# EAGLE design radiomodul (EAGLE 8.5.1)

## Sheet 1 of 3: MCU
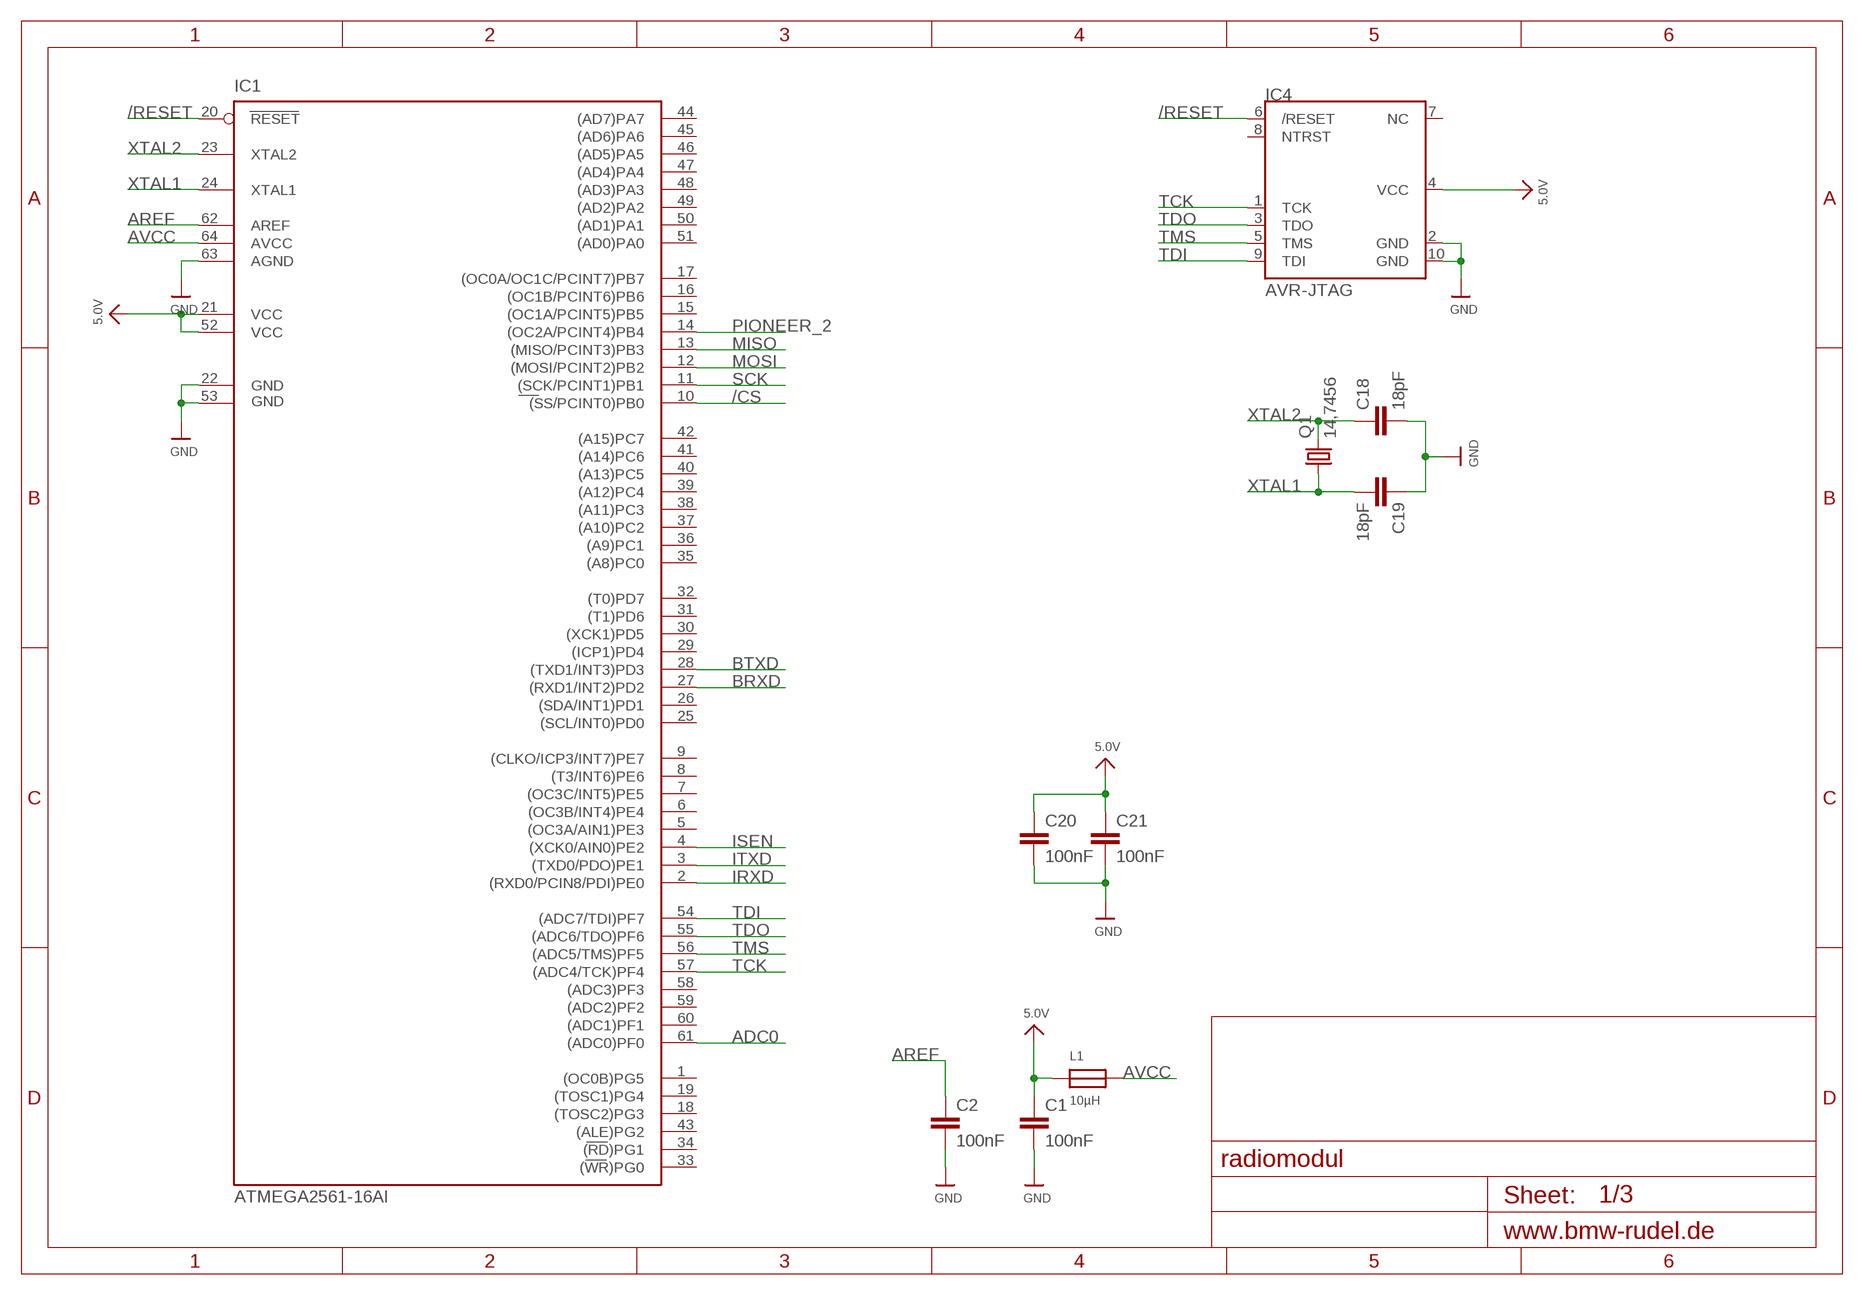
[diagram p0: schematic, sheet 1]

### Parts
C1  100nF  C-EUC0805  [C0805]
C2  100nF  C-EUC0805  [C0805]
C18  18pF  C-EUC0805  [C0805]
C19  18pF  C-EUC0805  [C0805]
C20  100nF  C-EUC0805  [C0805]
C21  100nF  C-EUC0805  [C0805]
IC1  ATMEGA2561-16AI  [TQFP64]
IC4  AVR-JTAG  [2X05_1.27MM_SMT]
L1  10µH  FERRITE1206  [1206]
Q1  14,7456  CRYSTALHC49UP  [HC49UP]

### Nets
5.0V: C1.1 C20.1 C21.1 IC1.21(VCC) IC1.52(VCC1) IC4.4(VCC) L1.1 ; also sheet 2,3
/CS: IC1.10((SS/PCINT0)PB0) ; also sheet 2
/RESET: IC1.20(RESET) IC4.6(/RESET) ; also sheet 3
ADC0: IC1.61((ADC0)PF0) ; also sheet 2
AREF: C2.1 IC1.62(AREF)
AVCC: IC1.64(AVCC) L1.2
BRXD: IC1.27((RXD1/INT2)PD2) ; also sheet 2
BTXD: IC1.28((TXD1/INT3)PD3) ; also sheet 2
GND: C1.2 C2.2 C18.2 C19.1 C20.2 C21.2 IC1.22(GND) IC1.53(GND1) IC1.63(AGND) IC4.2(GND) IC4.10(GND) ; also sheet 2,3
IRXD: IC1.2((RXD0/PCIN8/PDI)PE0) ; also sheet 2
ISEN: IC1.4((XCK0/AIN0)PE2) ; also sheet 2
ITXD: IC1.3((TXD0/PDO)PE1) ; also sheet 2
MISO: IC1.13((MISO/PCINT3)PB3) ; also sheet 2
MOSI: IC1.12((MOSI/PCINT2)PB2) ; also sheet 2
PIONEER_2: IC1.14((OC2A/PCINT4)PB4) ; also sheet 3
SCK: IC1.11((SCK/PCINT1)PB1) ; also sheet 2
TCK: IC1.57((ADC4/TCK)PF4) IC4.1(TCK)
TDI: IC1.54((ADC7/TDI)PF7) IC4.9(TDI)
TDO: IC1.55((ADC6/TDO)PF6) IC4.3(TDO)
TMS: IC1.56((ADC5/TMS)PF5) IC4.5(TMS)
XTAL1: C19.2 IC1.24(XTAL1) Q1.1
XTAL2: C18.1 IC1.23(XTAL2) Q1.2
Unconnected: IC1.1((OC0B)PG5) IC1.5((OC3A/AIN1)PE3) IC1.6((OC3B/INT4)PE4) IC1.7((OC3C/INT5)PE5) IC1.8((T3/INT6)PE6) IC1.9((CLKO/ICP3/INT7)PE7) IC1.15((OC1A/PCINT5)PB5) IC1.16((OC1B/PCINT6)PB6) IC1.17((OC0A/OC1C/PCINT7)PB7) IC1.18((TOSC2)PG3) IC1.19((TOSC1)PG4) IC1.25((SCL/INT0)PD0) IC1.26((SDA/INT1)PD1) IC1.29((ICP1)PD4) IC1.30((XCK1)PD5) IC1.31((T1)PD6) IC1.32((T0)PD7) IC1.33((WR)PG0) IC1.34((RD)PG1) IC1.35((A8)PC0) IC1.36((A9)PC1) IC1.37((A10)PC2) IC1.38((A11)PC3) IC1.39((A12)PC4) IC1.40((A13)PC5) IC1.41((A14)PC6) IC1.42((A15)PC7) IC1.43((ALE)PG2) IC1.44((AD7)PA7) IC1.45((AD6)PA6) IC1.46((AD5)PA5) IC1.47((AD4)PA4) IC1.48((AD3)PA3) IC1.49((AD2)PA2) IC1.50((AD1)PA1) IC1.51((AD0)PA0) IC1.58((ADC3)PF3) IC1.59((ADC2)PF2) IC1.60((ADC1)PF1) IC4.7(NC) IC4.8(NTRST)

## Sheet 2 of 3: Connectivity
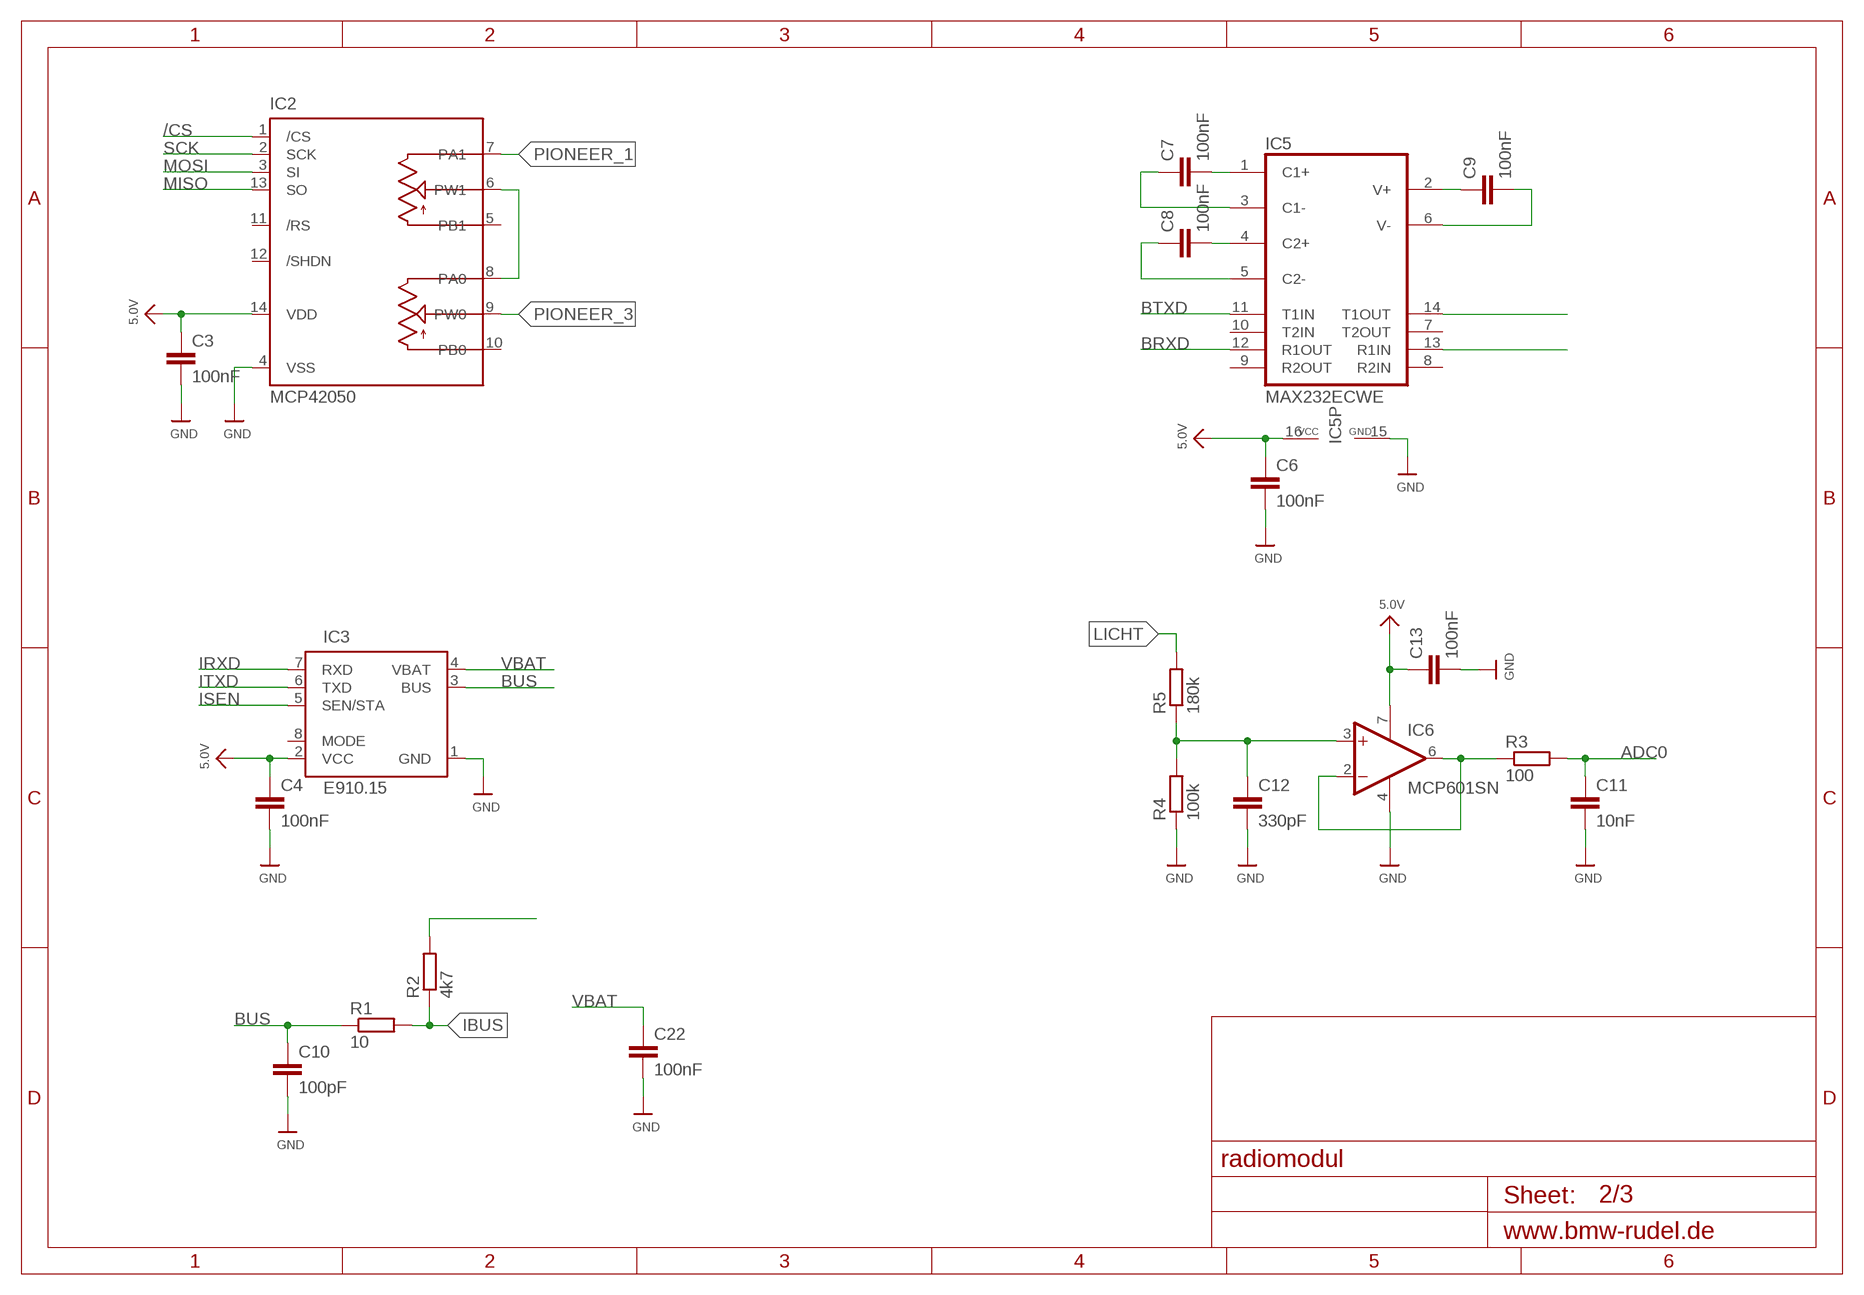
[diagram p1: schematic, sheet 2]

### Parts
C3  100nF  C-EUC0805  [C0805]
C4  100nF  C-EUC0805  [C0805]
C6  100nF  C-EUC0805  [C0805]
C7  100nF  C-EUC0805  [C0805]
C8  100nF  C-EUC0805  [C0805]
C9  100nF  C-EUC0805  [C0805]
C10  100pF  C-EUC0805  [C0805]
C11  10nF  C-EUC0805  [C0805]
C12  330pF  C-EUC0805  [C0805]
C13  100nF  C-EUC0805  [C0805]
C22  100nF  C-EUC0805  [C0805]
IC2  MCP42050  [SO-14]
IC3  E910.15  [SO8]
IC5  MAX232ECWE  [SO16L]
IC6  MCP601SN  [SO08]
R1  10  R-EU_R0805  [R0805]
R2  4k7  R-EU_R0805  [R0805]
R3  100  R-EU_R0805  [R0805]
R4  100k  R-EU_R0805  [R0805]
R5  180k  R-EU_R0805  [R0805]

### Nets
5.0V: C3.1 C4.1 C6.1 C13.1 IC2.14(VDD) IC3.2(VCC) IC5.16(VCC) IC6.7(V+) ; also sheet 1,3
/CS: IC2.1(/CS) ; also sheet 1
ADC0: C11.1 R3.2 ; also sheet 1
BECKER_RXD: IC5.13(R1IN) ; also sheet 3
BECKER_TXD: IC5.14(T1OUT) ; also sheet 3
BRXD: IC5.12(R1OUT) ; also sheet 1
BTXD: IC5.11(T1IN) ; also sheet 1
BUS: C10.1 IC3.3(BUS) R1.1
GND: C3.2 C4.2 C6.2 C10.2 C11.2 C12.2 C13.2 C22.2 IC2.4(VSS) IC3.1(GND) IC5.15(GND) IC6.4(V-) R4.1 ; also sheet 1,3
IBUS: R1.2 R2.1 ; also sheet 3
IRXD: IC3.7(RXD) ; also sheet 1
ISEN: IC3.5(SEN/STA) ; also sheet 1
ITXD: IC3.6(TXD) ; also sheet 1
LICHT: R5.2 ; also sheet 3
MISO: IC2.13(SO) ; also sheet 1
MOSI: IC2.3(SI) ; also sheet 1
N$1: IC2.6(PW1) IC2.8(PA0)
N$4: C7.1 IC5.3(C1-)
N$5: C12.1 IC6.3(+IN) R4.2 R5.1
N$6: C8.1 IC5.5(C2-)
N$7: IC6.2(-IN) IC6.6(OUT) R3.1
N$8: C8.2 IC5.4(C2+)
N$9: C9.2 IC5.6(V-)
N$10: C9.1 IC5.2(V+)
N$11: C7.2 IC5.1(C1+)
PIONEER_1: IC2.7(PA1) ; also sheet 3
PIONEER_3: IC2.9(PW0) ; also sheet 3
SAFT: R2.2 ; also sheet 3
SCK: IC2.2(SCK) ; also sheet 1
VBAT: C22.1 IC3.4(VBAT)
Unconnected: IC2.5(PB1) IC2.10(PB0) IC2.11(/RS) IC2.12(/SHDN) IC3.8(MODE) IC5.7(T2OUT) IC5.8(R2IN) IC5.9(R2OUT) IC5.10(T2IN)

## Sheet 3 of 3: Power
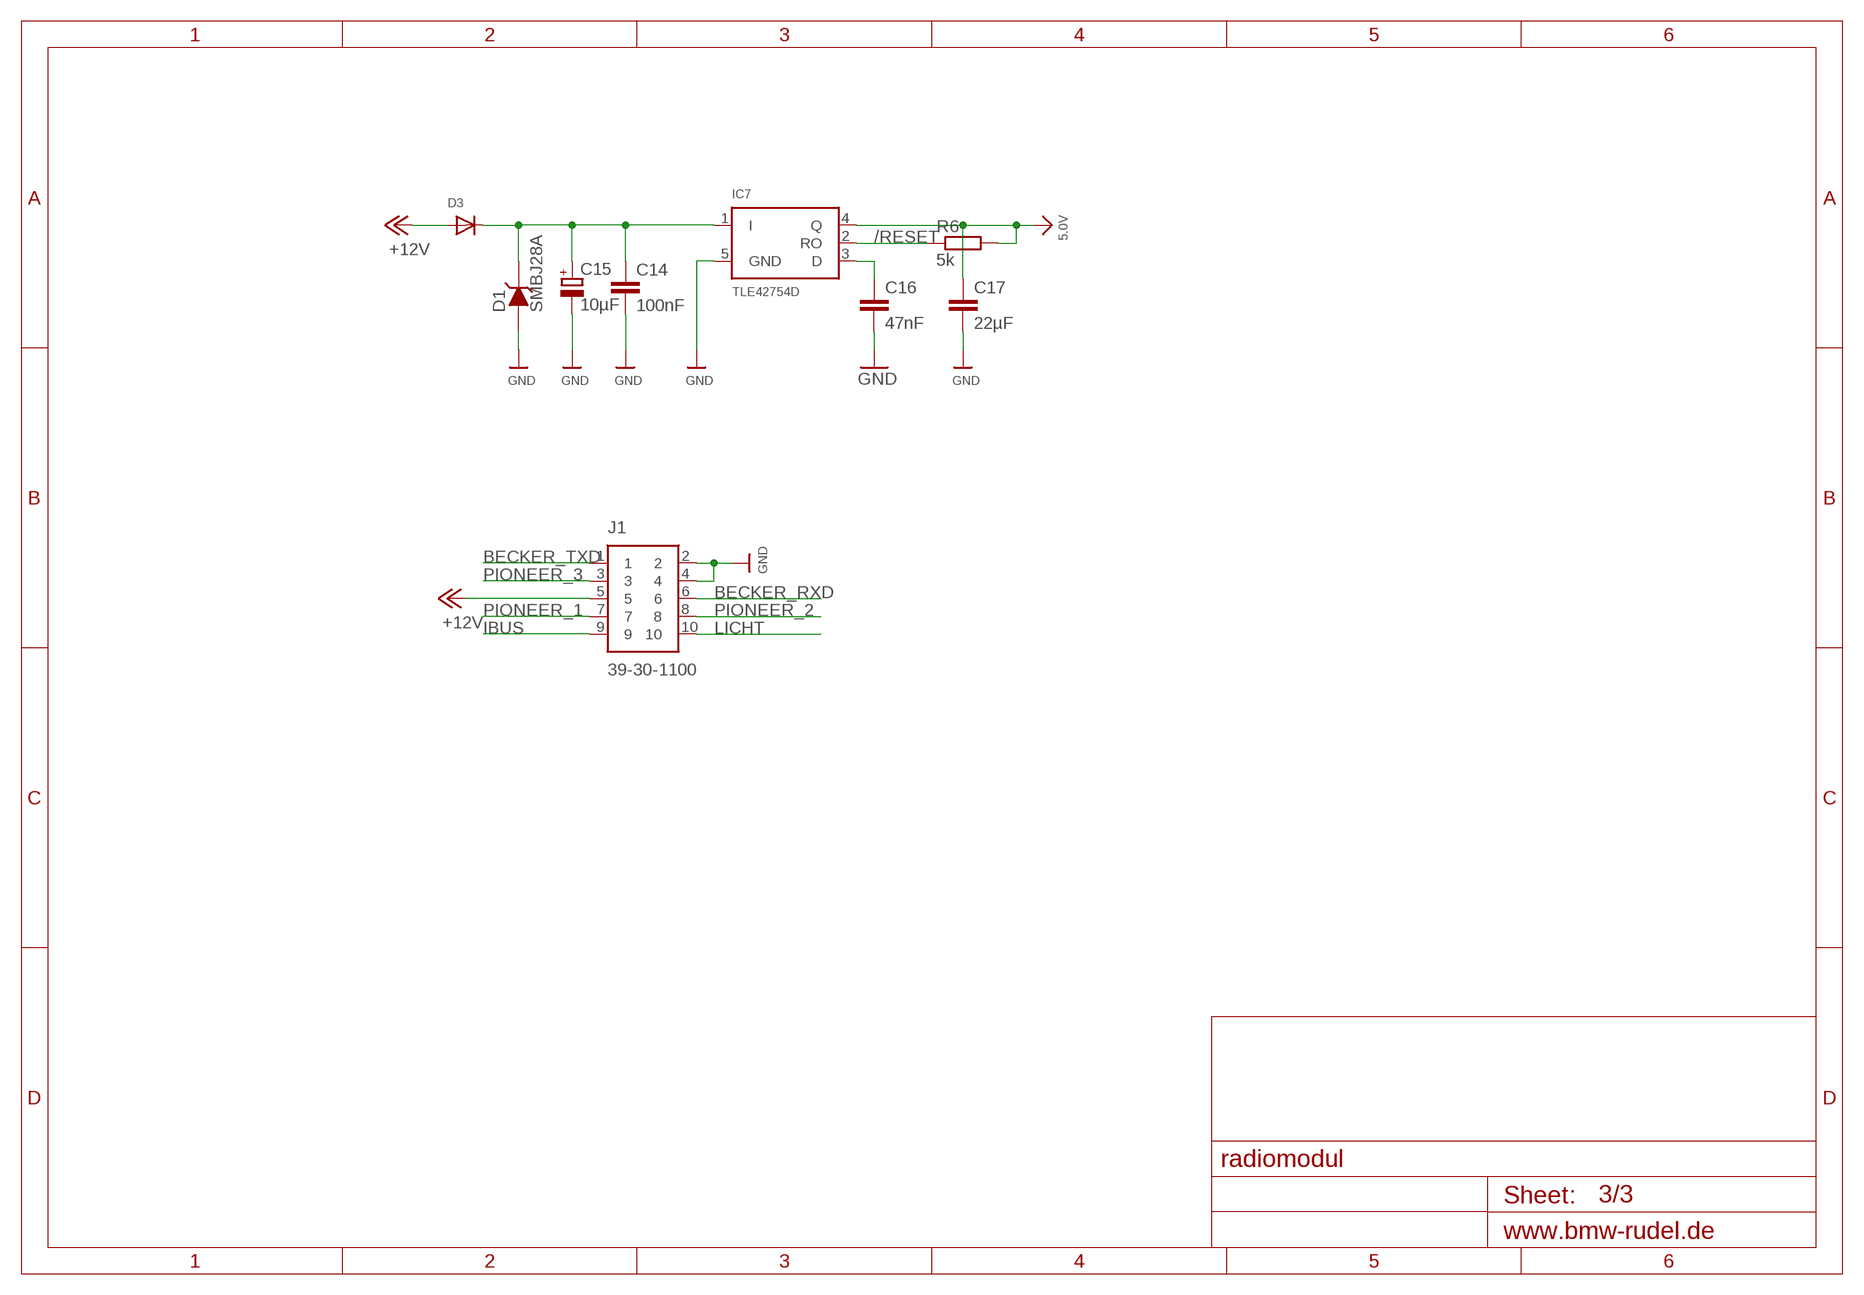
[diagram p2: schematic, sheet 3]

### Parts
C14  100nF  C-EUC0805  [C0805]
C15  10µF  CPOL-EUD  [PANASONIC_D]
C16  47nF  C-EUC0805  [C0805]
C17  22µF  C-EUC1206  [C1206]
D1  SMBJ28A  P6SMBXXASMB  [DO-214AA]
D3  DIODESMA  [SMADIODE]
IC7  TLE42754D  [TO252-51]
J1  39-30-1100  [39-30-1100]
R6  5k  R-EU_R0805  [R0805]

### Nets
5.0V: C17.1 IC7.4(Q) R6.2 ; also sheet 1,2
+12V: D3.A J1.5
/RESET: IC7.2(RO) R6.1 ; also sheet 1
BECKER_RXD: J1.6 ; also sheet 2
BECKER_TXD: J1.1 ; also sheet 2
GND: C14.2 C15.- C16.2 C17.2 D1.P$2(A) IC7.5(GND) J1.2 J1.4 ; also sheet 1,2
IBUS: J1.9 ; also sheet 2
LICHT: J1.10 ; also sheet 2
N$14: C16.1 IC7.3(D)
PIONEER_1: J1.7 ; also sheet 2
PIONEER_2: J1.8 ; also sheet 1
PIONEER_3: J1.3 ; also sheet 2
SAFT: C14.1 C15.+ D1.P$1(C) D3.C IC7.1(I) ; also sheet 2

## Library data of the parts
C1-C4 C6-C14 C16-C22 = rcl:C-EU: CAPACITOR, European symbol; SPICEPREFIX: C
C15 = rcl:CPOL-EU: POLARIZED CAPACITOR, European symbol; SPICEPREFIX: C
D1 = Heinrich:P6SMBXXA: SMBxxAT3G TVS Diode The SMB series is designed to protect voltage sensitive components from high voltage, high energy transients. They have excellent clamping capability, high surge capability, low zener impedance and fast response time. The SMB series is supplied in ON Semiconductor’s exclusive, cost-effective, highly reliable SURMETIC® package and is ideally suited for use in communication systems, automotive, numerical controls, process controls, medical equipment, business machines, power supplies and many other industrial/consumer applications. http://www.onsemi.com/pub_link/Collateral/P6SMB6.8AT3-D.PDF <datasheet.pdf>
D3 = Heinrich:DIODE: Diode SMADIODE - SMA Surface Mount Package 20V 1A Schottky Diode Digikey (500mV @ 1A, 500uA Vr @ 20V): 641-1014-6-ND SOD-123 30V 500mA (430mV Vf, 130uA Vr @ 30V) Schottky Diode - Digikey: B0530W-FDICT-ND SOD-323 10V 570mA (380mV Vf, 3ns) Schottky Diode - Digikey: ZLLS410CT-ND SOD-523 30V 30mA Schottky Diode (RB751S-40TE61) - Digikey: RB751S-40TE61CT-ND SOT23-R/W - SOT23 Package (R = Solder Paste/Reflow Ovens, W = Hand-Soldering) BAT54Film 40V 300mA - Digikey: 497-7162-1-ND DO-1N4148 Through Hole Small Current Diode (any model)
IC1 = atmel-2005:ATMEGA2561*: MICROCONTROLLER 256 Kbytes FLASH 4 Kbytes EEPROM 8 Kbytes SRAM 54 General Purpose I/O pins 6-channels 16-bit PWM 2 x Serial USARTs 8-channels 10-bit A/D
IC2 = Heinrich:MCP42050: The MCP42050 digital potentiometer features two independent channels, 8-bit resolution (256 wiper steps), and an industry-standard SPI serial interface. The wiper position varies linearly and is controlled via the SPI interface. The MCP42050 has a resistance value of 50 kohm, outstanding AC and DC characteristics, and consumes <1 ?A during static operation. Applications for the MCP42050 digital potentiometer include audio equipment (volume and tone controls), servo-motor control, battery charging and control, communications (line impedance matching), power supplies, instrumentation (gain, offset adjust), LCD contrast control and programmable filters. The MCP42050 is available in 14-pin PDIP, SOIC and TSSOP packages.
IC3 = Heinrich:E910.15: Elmos E910.15 Elmos E910.15 LIN-/K-Bus Transceiver. Pin description: 1: Ground 2: +5V supply 3: Bus-Connection 4: +12V supply 5: I/O Pin send status 6: Serial data from MCU to IC 7: Serial data from IC to MCU 8: Mode-selection: 1 = not connected: K-Bus-Mode; 0: LIN-Bus mode
IC4 = Heinrich:AVR-JTAG
IC5 = maxim:MAX232ECWE: RS232 TRANSCEIVER; MF: MAXIM; MPN: MAX232ECWE+; OC_FARNELL: 9724435; OC_NEWARK: 67K4440
IC6 = linear:MCP601: Single Op Amp 2.7V to 6.0V Single Supply CMOS Source: http://ww1.microchip.com/downloads/en/DeviceDoc/21314g.pdf
IC7 = Heinrich:TLE42754
J1 = Heinrich:39-30-1100: 10 way r/a PCB header w/peg,Mini-Fit Jr Molex MINI-FIT JR. Series, Series Number 5569, 4.2mm Pitch 10 Way 2 Row Shrouded Right Angle PCB Header, Through Hole Source: Datasheet <http://www.molex.com/webdocs/datasheets/pdf/en-us//0039301100_PCB_HEADERS.pdf>; ALLIED_NUMBER: 70190658; ALLIED_PRICE-STOCK: https://www.alliedelec.com/molex-incorporated-39-30-1100/70190658/; DESCRIPTION: 10 way r/a PCB header w/peg,Mini-Fit Jr Molex MINI-FIT JR. Series, Series Number 5569, 4.2mm Pitch 10 Way 2 Row Shrouded Right Angle PCB Header, Through Hole; HEIGHT: mm; MANUFACTURER_NAME: Molex; MANUFACTURER_PART_NUMBER: 39-30-1100; MOUSER_PART_NUMBER: 538-39-30-1100; MOUSER_PRICE-STOCK: https://www.mouser.com/Search/Refine.aspx?Keyword=538-39-30-1100; RS_PART_NUMBER: 5109871P; RS_PRICE-STOCK: http://uk.rs-online.com/web/p/products/5109871P
L1 = Heinrich:FERRITE: Ferrite Bead 0603 120 Ohm, 600mA Ferrite Chip - Digikey: 445-2164-1-ND
Q1 = crystal:CRYSTAL: CRYSTAL; OC_FARNELL: unknown; OC_NEWARK: unknown
R1-R6 = rcl:R-EU_: RESISTOR, European symbol; SPICEPREFIX: R

## Board
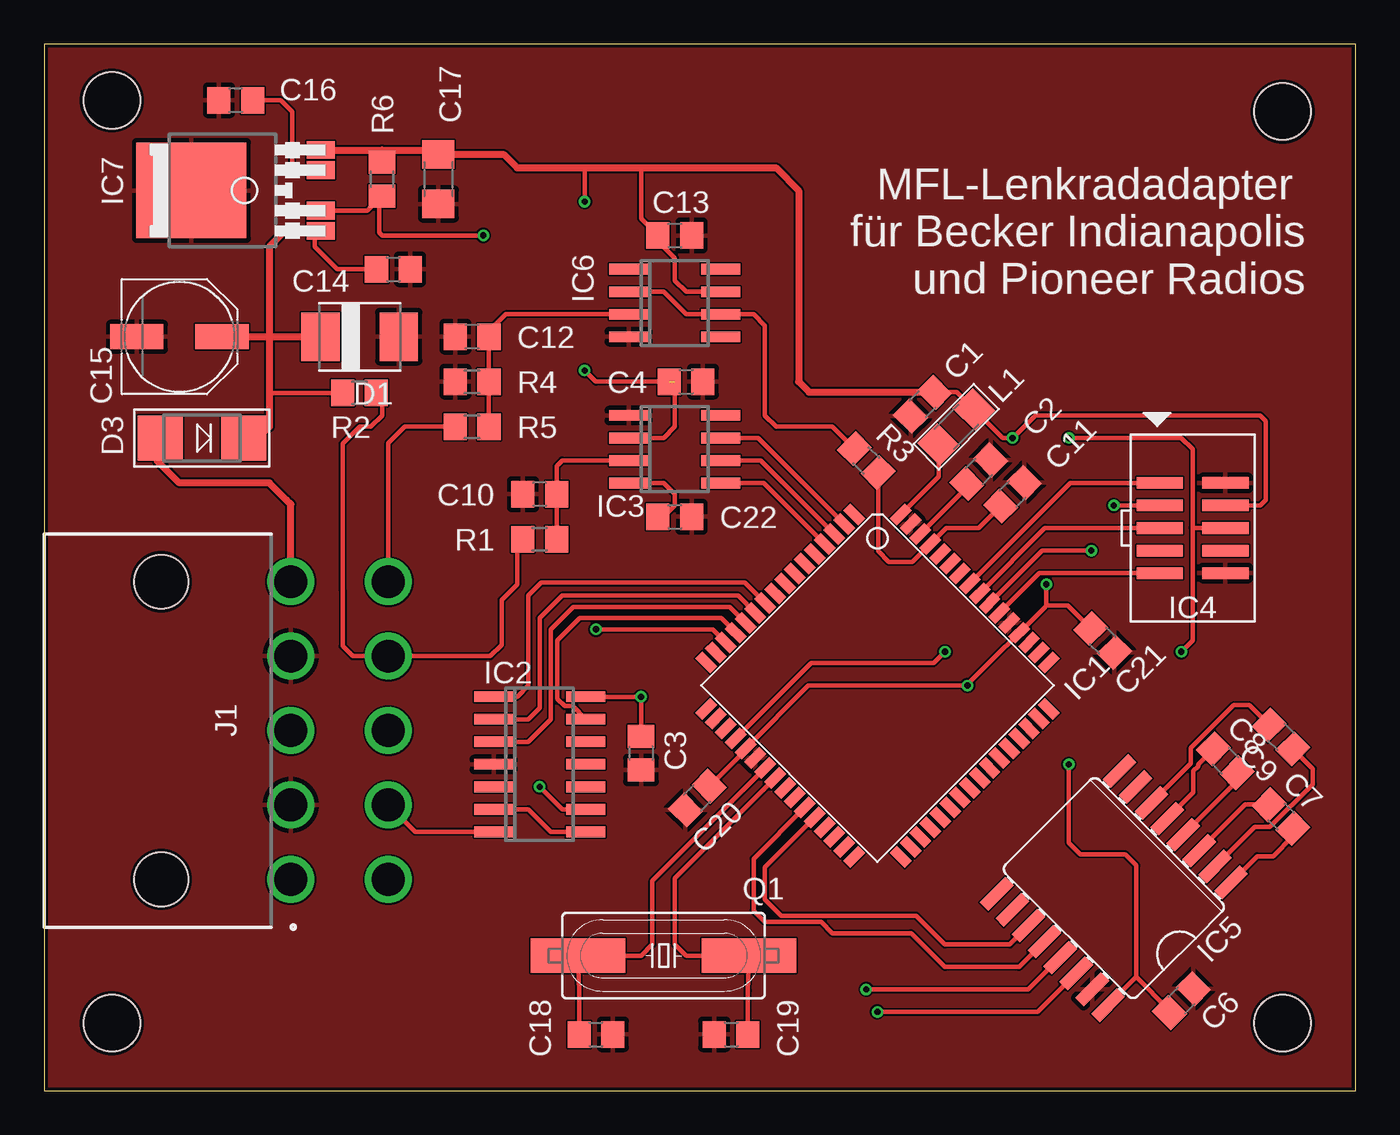
[diagram p3: board, top side]
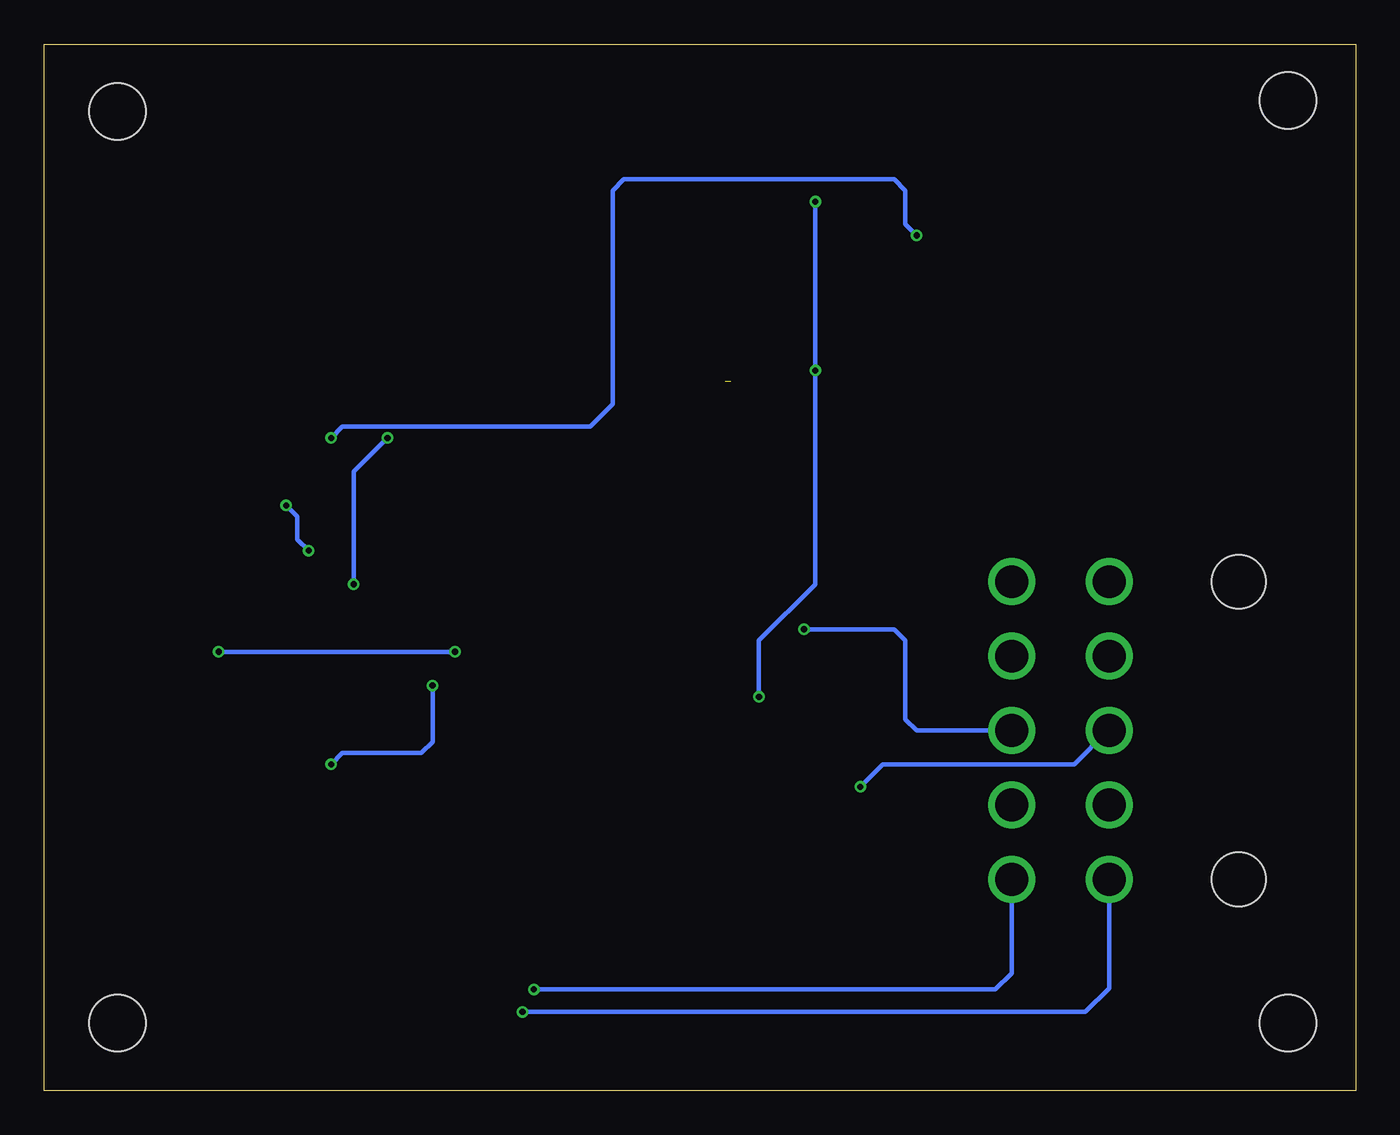
[diagram p4: board, bottom side, seen from below]

Size 73.97 x 59.05 mm. Coordinates in mm from the lower left corner, seen from the top.
Outline: 0,0 73.97,0 73.97,59.05 0,59.05 0,0
Copper layers (1*16): Top 0.035mm / dielectric 1.5mm / Bottom 0.035mm
Design rules "aisler_2_layer": minimum track width 0.1mm, minimum drill 0.2mm, track to track 0.1mm, track to pad 0.1mm, pad to pad 0.1mm, via to via 0.1mm, smd to smd 0.1mm, copper to edge 0.2mm, drill to drill 0.21mm, minimum pad ring 0.25mm, minimum via ring 0.15mm, stop-mask expansion 0mil, vias tented up to drill 0mil, thermal gap 10mil
Holes 3.2 mm at 3.81,3.81 69.85,3.81 69.85,55.24 3.81,55.88

### Footprints (pad centres in the part's own frame; a part is rotated, then mirrored left to right if it is on the bottom)
C0805 = smd 1.3 x 1.5: 1 -0.95,0; 2 0.95,0
PANASONIC_D = smd 3 x 1.4: + 2.4,0; - -2.4,0
C1206 = smd 1.6 x 1.8: 1 -1.4,0; 2 1.4,0
DO-214AA = smd 2.159 x 2.743: P$1 -2.21,0; P$2 2.21,0
SMADIODE = smd 2.54 x 2.54: A 2.349,0; C -2.349,0
TQFP64 = smd 1.194 x 0.559: 1 -7.76,5.905; 2 -7.76,5.118; 3 -7.76,4.331; 4 -7.76,3.543; 5 -7.76,2.756; 6 -7.76,1.968; 7 -7.76,1.181; 8 -7.76,0.394; 9 -7.76,-0.394; 10 -7.76,-1.181; 11 -7.76,-1.968; 12 -7.76,-2.756; 13 -7.76,-3.543; 14 -7.76,-4.331; 15 -7.76,-5.118; 16 -7.76,-5.905; 33 7.76,-5.905; 34 7.76,-5.118; 35 7.76,-4.331; 36 7.76,-3.543; 37 7.76,-2.756; 38 7.76,-1.968; 39 7.76,-1.181; 40 7.76,-0.394; 41 7.76,0.394; 42 7.76,1.181; 43 7.76,1.968; 44 7.76,2.756; 45 7.76,3.543; 46 7.76,4.331; 47 7.76,5.118; 48 7.76,5.905 | smd 0.559 x 1.194: 17 -5.905,-7.76; 18 -5.118,-7.76; 19 -4.331,-7.76; 20 -3.543,-7.76; 21 -2.756,-7.76; 22 -1.968,-7.76; 23 -1.181,-7.76; 24 -0.394,-7.76; 25 0.394,-7.76; 26 1.181,-7.76; 27 1.968,-7.76; 28 2.756,-7.76; 29 3.543,-7.76; 30 4.331,-7.76; 31 5.118,-7.76; 32 5.905,-7.76; 49 5.905,7.76; 50 5.118,7.76; 51 4.331,7.76; 52 3.543,7.76; 53 2.756,7.76; 54 1.968,7.76; 55 1.181,7.76; 56 0.394,7.76; 57 -0.394,7.76; 58 -1.181,7.76; 59 -1.968,7.76; 60 -2.756,7.76; 61 -3.543,7.76; 62 -4.331,7.76; 63 -5.118,7.76; 64 -5.905,7.76
SO-14 = smd 0.6 x 2.2: 1 -3.81,-2.6; 2 -2.54,-2.6; 3 -1.27,-2.6; 4 0,-2.6; 5 1.27,-2.6; 6 2.54,-2.6; 7 3.81,-2.6; 8 3.81,2.6; 9 2.54,2.6; 10 1.27,2.6; 11 0,2.6; 12 -1.27,2.6; 13 -2.54,2.6; 14 -3.81,2.6
SO8 = smd 0.6 x 2.2: 1 -1.905,-2.6; 2 -0.635,-2.6; 3 0.635,-2.6; 4 1.905,-2.6; 5 1.905,2.6; 6 0.635,2.6; 7 -0.635,2.6; 8 -1.905,2.6
2X05_1.27MM_SMT = smd 0.65 x 2.6: 1 -2.54,-1.85; 2 -2.54,1.85; 3 -1.27,-1.85; 4 -1.27,1.85; 5 0,-1.85; 6 0,1.85; 7 1.27,-1.85; 8 1.27,1.85; 9 2.54,-1.85; 10 2.54,1.85
SO16L = smd 0.66 x 2.032: 1 -4.445,-4.902; 2 -3.175,-4.902; 3 -1.905,-4.902; 4 -0.635,-4.902; 5 0.635,-4.902; 6 1.905,-4.902; 7 3.175,-4.902; 8 4.445,-4.902; 9 4.445,4.902; 10 3.175,4.902; 11 1.905,4.902; 12 0.635,4.902; 13 -0.635,4.902; 14 -1.905,4.902; 15 -3.175,4.902; 16 -4.445,4.902
SO08 = smd 0.6 x 2.2: 1 -1.905,-2.6; 2 -0.635,-2.6; 3 0.635,-2.6; 4 1.905,-2.6; 5 1.905,2.6; 6 0.635,2.6; 7 -0.635,2.6; 8 -1.905,2.6
TO252-51 = smd 1 x 1.6: 1 -2.28,-4.8; 2 -1.14,-4.8; 3 1.14,-4.8; 4 2.28,-4.8 | smd 5.4 x 6.2: 5 0,2.5
39-30-1100 = drill 1.85 pad 2.65: 1 8.4,13.9; 2 4.2,13.9; 3 0,13.9; 4 -4.2,13.9; 5 -8.4,13.9; 6 8.4,19.4; 7 4.2,19.4; 8 0,19.4; 9 -4.2,19.4; 10 -8.4,19.4 | hole 3.05: -8.4,6.6; 8.4,6.6
1206 = smd 1.6 x 1.8: 1 -1.4,0; 2 1.4,0
HC49UP = smd 5.334 x 1.93: 1 -4.826,0; 2 4.826,0
R0805 = smd 1.3 x 1.5: 1 -0.95,0; 2 0.95,0

### Placement (x,y rotation side)
C1  49.53,38.73 225 top
C2  52.7,34.92 45 top
C3  33.66,19.05 270 top
C4  36.2,40.01 0 top
C6  64.14,5.08 45 top
C7  69.75,15.47 315 top
C8  66.61,18.61 315 top
C9  69.75,19.96 135 top
C10  27.94,33.66 180 top
C11  54.61,33.66 45 top
C12  24.13,42.55 180 top
C13  35.56,48.26 0 top
C14  19.68,46.35 0 top
C15  7.62,42.55 0 top
C16  10.79,55.88 180 top
C17  22.23,51.44 270 top
C18  31.11,3.17 0 top
C19  38.73,3.17 0 top
C20  36.83,16.51 225 top
C21  59.69,25.4 315 top
C22  35.56,32.38 0 top
D1  17.78,42.55 0 top
D3  8.89,36.83 180 top
IC1  46.99,22.86 315 top
IC2  27.94,18.41 270 top
IC3  35.56,36.2 270 top
IC4  64.77,31.75 270 top
IC5  60.33,11.43 135 top
IC6  35.56,44.45 270 top
IC7  10.79,50.8 90 top
J1  0,20.32 270 top
L1  51.44,37.47 225 top
Q1  34.92,7.62 180 top
R1  27.94,31.11 180 top
R2  17.78,39.37 180 top
R3  46.35,35.56 315 top
R4  24.13,40.01 0 top
R5  24.13,37.47 180 top
R6  19.05,51.44 90 top

### Tracks (layer width: path | path; a pad name or v marks a point on that pad's centre or on a via)
5.0V  (via drill 0.35)  (1 unrouted)
  Top 0.254: 37.5,17.27 C20.1 39.55,19.23 IC1.21 43.09,22.86 v52.07,22.86 52,22.86 56.45,27.3 | 56.45,27.3 56.52,27.37 | 56.52,27.37 v56.52,28.57 | IC6.7 36.2,45.09 35.56,45.72 35.56,46.99 34.61,47.94 C13.1 33.66,49.22 33.66,52.07 | IC3.2 34.92,36.83 35.56,37.47 35.56,40.01 | C4.1 31.11,40.01 v30.48,40.64 | 30.48,52.07 v30.48,50.16 | C1.1 51.47,39.41 L1.1 54.05,36.83 v54.61,36.83 55.88,38.1 68.58,38.1 68.9,37.78 68.9,33.34 68.58,33.02 IC4.4 | IC2.14 v33.66,22.23 C3.1 | IC1.52 56.45,27.3 | 56.45,27.3 | 56.52,27.37 57.72,27.37 C21.1 | IC5.16 61.59,6.41 | v57.78,18.41 57.78,13.97 58.42,13.34 60.96,13.34 61.59,12.7 61.59,6.41 | 61.59,6.41 63.46,4.55 C6.1
  Top 0.406: IC7.4 19.05,53.08 | R6.2 19.05,53.08 | 22.04,52.38 C17.1 | 19.05,53.08 21.98,53.08 C17.1 | C17.1 25.91,52.84 26.67,52.07 30.48,52.07 33.66,52.07 41.27,52.07 42.55,50.8 42.55,40.01 43.14,39.41 C1.1
  Bottom 0.254: v56.52,28.57 56.52,34.92 v54.61,36.83 | v30.48,50.16 v30.48,40.64 30.48,28.57 33.66,25.4 v33.66,22.23 | v52.07,22.86 52.07,19.68 52.7,19.05 57.15,19.05 v57.78,18.41
+12V
  Top 0.406: D3.A 6.35,36.64 6.35,35.56 7.62,34.29 12.7,34.29 13.65,33.34 13.82,33.16 13.9,33.09 J1.5
/CS
  Top 0.254: IC2.1 26.67,22.23 27.3,22.86 27.3,27.94 28.03,28.66 39.52,28.66 IC1.10
/RESET  (via drill 0.35)
  Top 0.254: IC7.2 18.23,49.66 18.89,50.33 | 18.89,50.33 R6.1 | IC1.20 43.25,24.13 50.16,24.13 v50.8,24.77 | v57.78,36.83 64.14,36.83 64.77,36.2 64.77,31.75 | v24.77,48.26 19.05,48.26 18.89,48.42 18.89,50.33 | 64.77,31.75 64.77,25.4 v64.14,24.77 | IC4.6 64.77,31.75
  Bottom 0.254: v64.14,24.77 v50.8,24.77 | v57.78,36.83 57.15,37.47 43.18,37.47 41.91,38.73 41.91,50.8 41.27,51.44 26.04,51.44 25.4,50.8 25.4,48.9 v24.77,48.26
ADC0
  Top 0.254: C11.1 52.7,31.75 50.87,31.75 IC1.61 48.96,29.84 47.62,29.84 47.03,30.44 R3.2
AREF
  Top 0.254: IC1.62 52.03,34.03 C2.1
AVCC
  Top 0.254: IC1.64 50.45,34.67 L1.2
BECKER_RXD  (via drill 0.35)
  Top 0.254: IC5.13 55.51,5.71 v46.35,5.71
  Bottom 0.254: J1.6 19.4,6.63 20.32,5.71 v46.35,5.71
BECKER_TXD  (via drill 0.35)
  Top 0.254: IC5.14 56.03,4.45 v46.99,4.45
  Bottom 0.254: J1.1 13.9,5.79 15.24,4.45 v46.99,4.45
BRXD
  Top 0.254: IC1.27 40.01,13.09 40.01,10.16 40.64,9.53 43.81,9.53 44.45,8.89 48.9,8.89 50.8,6.99 54.98,6.99 IC5.12
BTXD
  Top 0.254: IC1.28 40.64,12.61 40.64,10.79 41.56,9.88 49.18,9.88 50.8,8.26 54.46,8.26 IC5.11
BUS
  Top 0.254: R1.1 C10.1 28.89,35.24 29.21,35.56 IC3.3
GND
  pour Top: -0.64,59.05 73.66,59.05 73.66,0 -0.64,0
IBUS
  Top 0.254: R1.2 26.67,30.8 26.67,28.57 25.79,27.7 25.79,25.16 25.16,24.52 J1.9 17.39,24.52 16.83,25.08 16.83,28.26 | 16.83,28.26 16.82,28.26 | 16.83,28.26 16.83,36.51 17.78,37.47 18.41,37.47 19.05,38.1 19.05,39.05 R2.1
IRXD
  Top 0.254: IC1.2 40.26,36.83 IC3.7
ISEN
  Top 0.254: IC1.4 40.57,34.29 IC3.5
ITXD
  Top 0.254: IC1.3 40.41,35.56 IC3.6
LICHT
  Top 0.254: J1.10 19.4,36.55 20.32,37.47 R5.2
MISO
  Top 0.254: IC2.13 29.8,21.7 29.35,21.7 28.93,22.11 28.93,25.4 30.2,26.67 38.17,26.67 IC1.13
MOSI
  Top 0.254: IC2.3 27.3,19.68 28.57,20.95 28.57,26.04 29.84,27.3 38.65,27.3 IC1.12
N$1
  Top 0.254: IC2.6 27.3,15.88 28.57,14.61 IC2.8
N$4
  Top 0.254: IC5.3 67.73,16.14 C7.1
N$5
  Top 0.254: R5.1 R4.2 C12.1 25.08,42.86 26.04,43.81 IC6.3
N$6
  Top 0.254: IC5.5 64.81,16.82 64.81,18.04 65.08,18.3 65.08,18.42 C8.1
N$7
  Top 0.254: IC6.2 34.92,45.09 36.2,43.81 IC6.6 40.01,43.81 40.64,43.18 40.64,38.1 41.27,37.47 44.45,37.47 45.09,36.83 | 45.05,36.87 45.09,36.83 | 45.09,36.83 R3.1 | 45.09,36.83
N$8
  Top 0.254: IC5.4 67.28,17.49 C8.2
N$9
  Top 0.254: IC5.6 64.67,18.47 64.67,19.33 67.1,21.76 67.96,21.76 C9.2
N$10
  Top 0.254: IC5.2 68.26,14.87 69.13,14.87 71.55,17.3 71.55,18.16 C9.1
N$11
  Top 0.254: IC5.1 68.41,13.23 69.31,13.23 70.43,14.35 C7.2
N$14
  Top 0.254: IC7.3 14.1,51.94 13.97,52.07 13.97,55.24 13.34,55.88 C16.1
PIONEER_1
  Top 0.254: IC2.7 20.91,14.61 J1.7
PIONEER_2  (via drill 0.35)
  Top 0.254: IC1.14 37.69,26.04 v31.11,26.04
  Bottom 0.254: v31.11,26.04 26.04,26.04 25.4,25.4 25.4,20.95 24.77,20.32 J1.8
PIONEER_3  (via drill 0.35)
  Top 0.254: IC2.9 29.21,15.88 v27.94,17.14
  Bottom 0.254: v27.94,17.14 26.67,18.41 15.88,18.41 13.97,20.32 J1.3
SAFT
  Top 0.254: R2.2 12.7,39.37 | C14.1 16.51,46.35 15.24,47.62 15.24,48.16 IC7.1
  Top 0.406: C15.+ 12.7,42.55 | 12.7,42.55 D1.P$1 | 12.7,42.55 12.7,47.62 13.6,48.52 IC7.1 | 12.7,42.55 12.7,39.37 12.7,37.47 12.06,36.83 D3.C
SCK
  Top 0.254: IC1.11 39.13,27.94 29.21,27.94 27.94,26.67 27.94,21.59 27.3,20.95 IC2.2
TCK
  Top 0.254: IC1.57 57.86,34.29 IC4.1
TDI
  Top 0.254: IC1.54 56.12,29.21 IC4.9
TDO  (via drill 0.35)
  Top 0.254: IC1.55 56.28,30.48 v59.05,30.48 | IC4.3 v60.33,33.02
  Bottom 0.254: v59.05,30.48 59.69,31.11 59.69,32.38 v60.33,33.02
TMS
  Top 0.254: IC1.56 56.44,31.75 IC4.5
VBAT
  Top 0.254: IC3.4 34.92,34.29 35.56,33.66 35.56,33.02 34.92,32.38 C22.1
XTAL1
  Top 0.254: C19.2 39.69,5.65 Q1.1 36.2,7.62 35.56,8.26 35.56,11.99 IC1.24
XTAL2
  Top 0.254: C18.1 30.16,5.65 Q1.2 33.66,7.62 34.29,8.26 34.29,11.83 IC1.23

### Text on the board
tNames: MFL-Lenkradadapter / für Becker Indianapolis / und Pioneer Radios